# Altium schematic sheet TempSense.SchDoc
size A
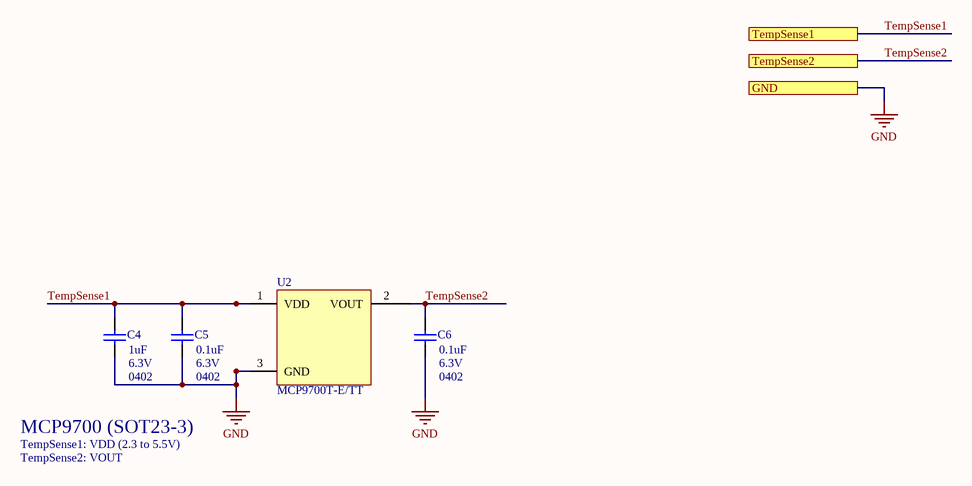
[diagram p0: TempSense.SchDoc]

## Parts
C4  value 1uF  Rated Voltage: 6.3V  Package: 0402  [CAPC1005X06N]  (hidden comment: Capacitor)
C5  value 0.1uF  Rated Voltage: 6.3V  Package: 0402  [CAPC1005X06N]  (hidden comment: Capacitor)
C6  value 0.1uF  Rated Voltage: 6.3V  Package: 0402  [CAPC1005X06N]  (hidden comment: Capacitor)
U2  MCP9700T-E/TT  [SOT95P237X112-3N]

## Ports
GND, TempSense1, TempSense2

## Nets
GND: C4.1 C5.1 C6.1 U2.3(GND) ; port GND
TempSense1: C4.2 C5.2 U2.1(VDD) ; port TempSense1
TempSense2: C6.2 U2.2(VOUT) ; port TempSense2

## Notes on the sheet
- MCP9700 (SOT23-3)
- TempSense1: VDD (2.3 to 5.5V)
- TempSense2: VOUT

## Library data of the parts
C4-C6 = Capacitor: General purpose capacitor
U2 = MCP9700T-E/TT: Low-Power Linear Active Thermistor IC, SOT-23-3 package